# EAGLE design Elect_5pulgadas_v1 (EAGLE 8.7.0)
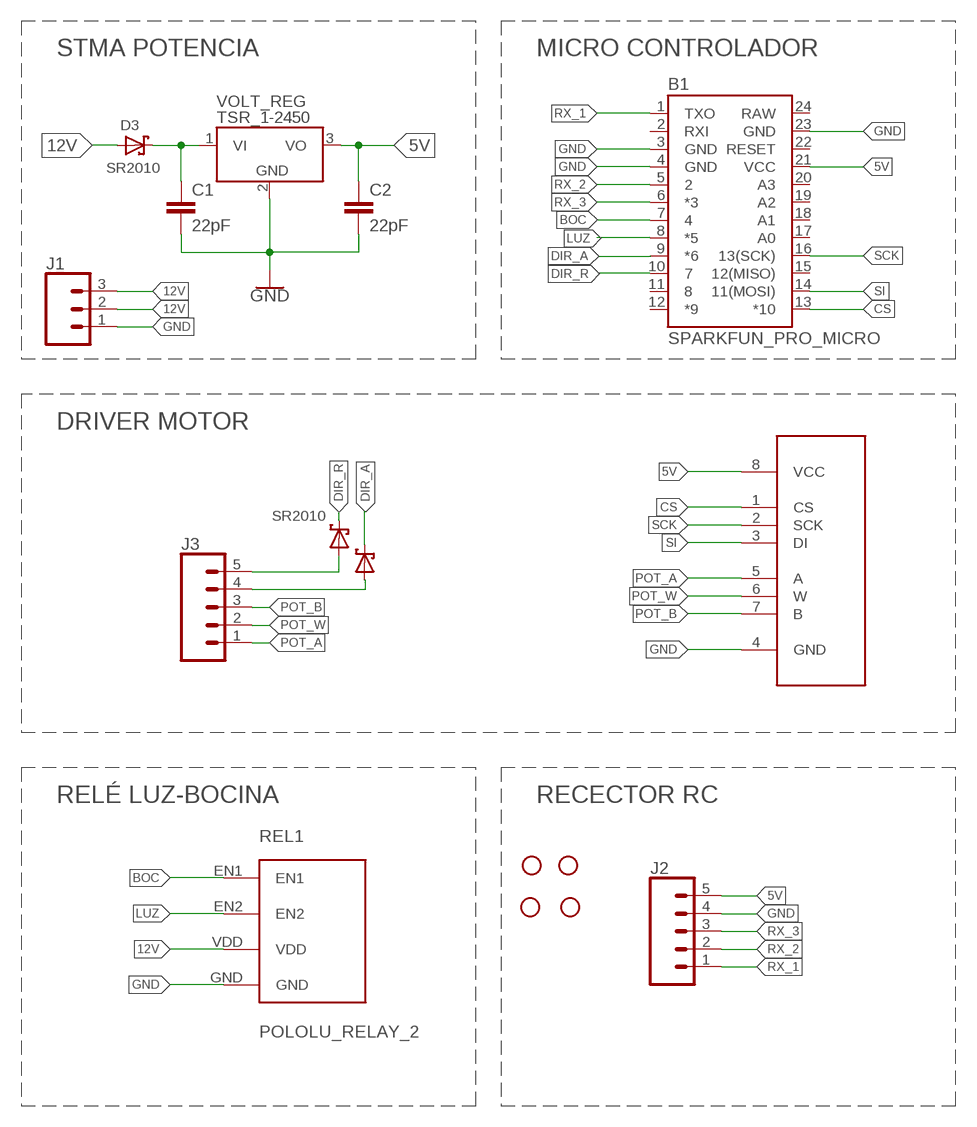
[diagram p0: schematic, sheet 1]

## Parts
B1  SPARKFUN_PRO_MICRO  [SPARKFUN_PRO_MICRO]
C1  22pF  0.1UF-KIT-EZ-50V-20%  [CAP-PTH-SMALL-KIT]
C2  22pF  0.1UF-KIT-EZ-50V-20%  [CAP-PTH-SMALL-KIT]
D1  SR2010  1N5817-B  [DO41-7.6]
D2  SR2010  1N5817-B  [DO41-7.6]
D3  SR2010  1N5817-B  [DO41-7.6]
H1  STAND-OFF  [STAND-OFF]
H2  STAND-OFF  [STAND-OFF]
H3  STAND-OFF  [STAND-OFF]
H4  STAND-OFF  [STAND-OFF]
J1  CONN_03-SCREW-5MM  [SCREWTERMINAL-5MM-3]
J2  CONN_05  [1X05]
J3  CONN_05  [1X05]
REL1  POLOLU_RELAY_2  [POLOLU_RELAY_2]
U1  MCP41XXX  MCP41XXXDIL  [DIP08]
VOLT_REG  TSR_1-2450  [TSR-1]

## Nets
5V: B1.21(VCC) C2.1 J2.5 U1.8(VCC) VOLT_REG.3(VO)
12V: D3.A J1.2 J1.3 REL1.VDD
BOC: B1.7 REL1.EN1
CS: B1.13(*10) U1.1(CS)
DIR_A: B1.9(*6) D1.C
DIR_R: B1.10 D2.C
GND: B1.3(GND) B1.4(GND) B1.23(GND) C1.2 C2.2 J1.1 J2.4 REL1.GND U1.4(GND) VOLT_REG.2(GND)
LUZ: B1.8(*5) REL1.EN2
N$6: D1.A J3.4
N$7: D2.A J3.5
POT_A: J3.1 U1.5(A)
POT_B: J3.3 U1.7(B)
POT_W: J3.2 U1.6(W)
RX_1: B1.1(TXO) J2.1
RX_2: B1.5 J2.2
RX_3: B1.6(*3) J2.3
SCK: B1.16(13(SCK)) U1.2(SCK)
SI: B1.14(11(MOSI)) U1.3(DI)
VI: C1.1 D3.C VOLT_REG.1(VI)
Unconnected: B1.2(RXI) B1.11 B1.12(*9) B1.15(12(MISO)) B1.17(A0) B1.18(A1) B1.19(A2) B1.20(A3) B1.22(RESET)

## Notes on the sheet
- STMA POTENCIA | MICRO CONTROLADOR
- DRIVER MOTOR
- RELÉ LUZ-BOCINA | RECECTOR RC

## Power pins joined to a net without a drawn wire
RAW: B1.24(RAW)

## Library data of the parts
B1 = SparkFun-Boards:SPARKFUN_PRO_MICRO: SparkFun Pro Micro Atmega32U4 compatible footprint. SparkFun Products: 3.3V/8MHz <https://www.sparkfun.com/products/12587> 5V/16MHz <https://www.sparkfun.com/products/12640>
C1 C2 = SparkFun-Capacitors:0.1UF: 0.1µF ceramic capacitors A capacitor is a passive two-terminal electrical component used to store electrical energy temporarily in an electric field.; PROD_ID: CAP-08370; VALUE: 0.1uF
D1-D3 = _mod_diode:1N581*: 1.0A SCHOTTKY BARRIER RECTIFIER Source: http://www.diodes.com/datasheets/ds23001.pdf
H1-H4 = SparkFun-Hardware:STAND-OFF: Stand Off Drill holes for mechanically mounting via screws, standoffs, etc. Note: Use the keepout ring to avoid running the screw head into surrounding components. Variant Overviews STAND-OFF - Mechanical footprint for a #4 phillips button head screw. STAND-OFF-TIGHT - Mechanical footprint for a #4 phillips button head screw, Example SparkFun Products Screw - Phillips Head (1/4", 4-40, 10 pack) <https://www.sparkfun.com/products/10453> (PRT-10453) Screw - Phillips Head (1/2", 4-40, 10 pack) <https://www.sparkfun.com/products/10452> (PRT-10452) Screw - Phillips Head (3/4", 4-40, 10 pack) <https://www.sparkfun.com/products/10451> (PRT-10451) Screw - Phillips Head (1", 4-40, 10 pack) <https://www.sparkfun.com/products/10450> (PRT-10450)
J1 = SparkFun-Connectors:CONN_03: Multi connection point. Often used as Generic Header-pin footprint for 0.1 inch spaced/style header connections On any of the 0.1 inch spaced packages, you can populate with these: Break Away Headers - Straight <https://www.sparkfun.com/products/116> (PRT-00116) Break Away Male Headers - Right Angle <https://www.sparkfun.com/products/553> (PRT-00553) Female Headers <https://www.sparkfun.com/products/115> (PRT-00115) Break Away Headers - Machine Pin <https://www.sparkfun.com/products/117> (PRT-00117) Break Away Female Headers - Swiss Machine Pin <https://www.sparkfun.com/products/743> (PRT-00743) Stackable Header - 3 Pin (Female, 0.1") <https://www.sparkfun.com/products/13875> (PRT-13875) For SCREWTERMINALS and SPRING TERMINALS visit here: Screw Terimnals on SparkFun.com <https://www.sparkfun.com/search/results?term=Screw+Terminals> (5mm/3.5mm/2.54mm spacing) This device is also useful as a general connection point to wire up your design to another part of your project. Our various solder wires solder well into these plated through hole pads. Hook-Up Wire - Assortment (Stranded, 22 AWG) <https://www.sparkfun.com/products/11375> (PRT-11375) Hook-Up Wire - Assortment (Solid Core, 22 AWG) <https://www.sparkfun.com/products/11367> (PRT-11367) View the entire wire category on our website here <https://www.sparkfun.com/categories/141> Special notes: Molex polarized connector foot print use with SKU : PRT-08232 with associated crimp pins and housings.; PROD_ID: CONN-10134; SF_SKU: PRT-08433
J2 J3 = SparkFun-Connectors:CONN_05: Multi connection point. Often used as Generic Header-pin footprint for 0.1 inch spaced/style header connections On any of the 0.1 inch spaced packages, you can populate with these: Break Away Headers - Straight <https://www.sparkfun.com/products/116> (PRT-00116) Break Away Male Headers - Right Angle <https://www.sparkfun.com/products/553> (PRT-00553) Female Headers <https://www.sparkfun.com/products/115> (PRT-00115) Break Away Headers - Machine Pin <https://www.sparkfun.com/products/117> (PRT-00117) Break Away Female Headers - Swiss Machine Pin <https://www.sparkfun.com/products/743> (PRT-00743) For SCREWTERMINALS and SPRING TERMINALS visit here: Screw Terimnals on SparkFun.com <https://www.sparkfun.com/search/results?term=Screw+Terminals> (5mm/3.5mm/2.54mm spacing) This device is also useful as a general connection point to wire up your design to another part of your project. Our various solder wires solder well into these plated through hole pads. Hook-Up Wire - Assortment (Stranded, 22 AWG) <https://www.sparkfun.com/products/11375> (PRT-11375) Hook-Up Wire - Assortment (Solid Core, 22 AWG) <https://www.sparkfun.com/products/11367> (PRT-11367) View the entire wire category on our website here <https://www.sparkfun.com/categories/141> Special notes: Molex polarized connector foot print use with SKU : PRT-08231 with associated crimp pins and housings. 1MM SMD Version SKU: PRT-10208
REL1 = POLOLU_RELAY_2:POLOLU_RELAY_2
U1 = SparkFun-IC-Special-Function:MCP41XXX: Digital Potentiometer - 10K SPI controlled single digital potentiometer by Microchip Datasheet <http://cdn.sparkfun.com/datasheets/Components/General%20IC/22060b.pdf> SparkFun Products Storefront component: Digital Potentiometer - 10K <https://www.sparkfun.com/products/10613> (COM-10613); PROD_ID: RES-13155
VOLT_REG = _traco_tsr-1:TSR_1-*: TRACO TSR-1 Series Point-of-Load DC/DC-Converters Vi max. 36 V; Vo = (1.2 .. 15)V ±2%; Io = 0 .. 1 A SIP-Package (drop-in replacement for 78xx linear voltage regulators in TO220-package, vertically assembled) Source: www.tracopower.com Technologies: TSR 1- Vi (V) Vo (V) ±2% Io = 0 .. 1 A 24_ ( generic ) 2412 4.6 .. 36 1.2 2415 4.6 .. 36 1.5 2418 4.6 .. 36 1.8 2425 4.6 .. 36 2.5 2433 4.75.. 36 3.3 2450 6.5 .. 36 5.0 2465 9.0 .. 36 6.5 2490 12 .. 36 9.0 24120 15 .. 36 12 24150 18 .. 36 15 Author: Dipl.-Ing. FH Rainer Bayer HHN Hochschule Heilbronn, rainer.bayer@hs-heilbronn.de Ingenieurbüro ing-rb, mail@ing-rb.de

## Board
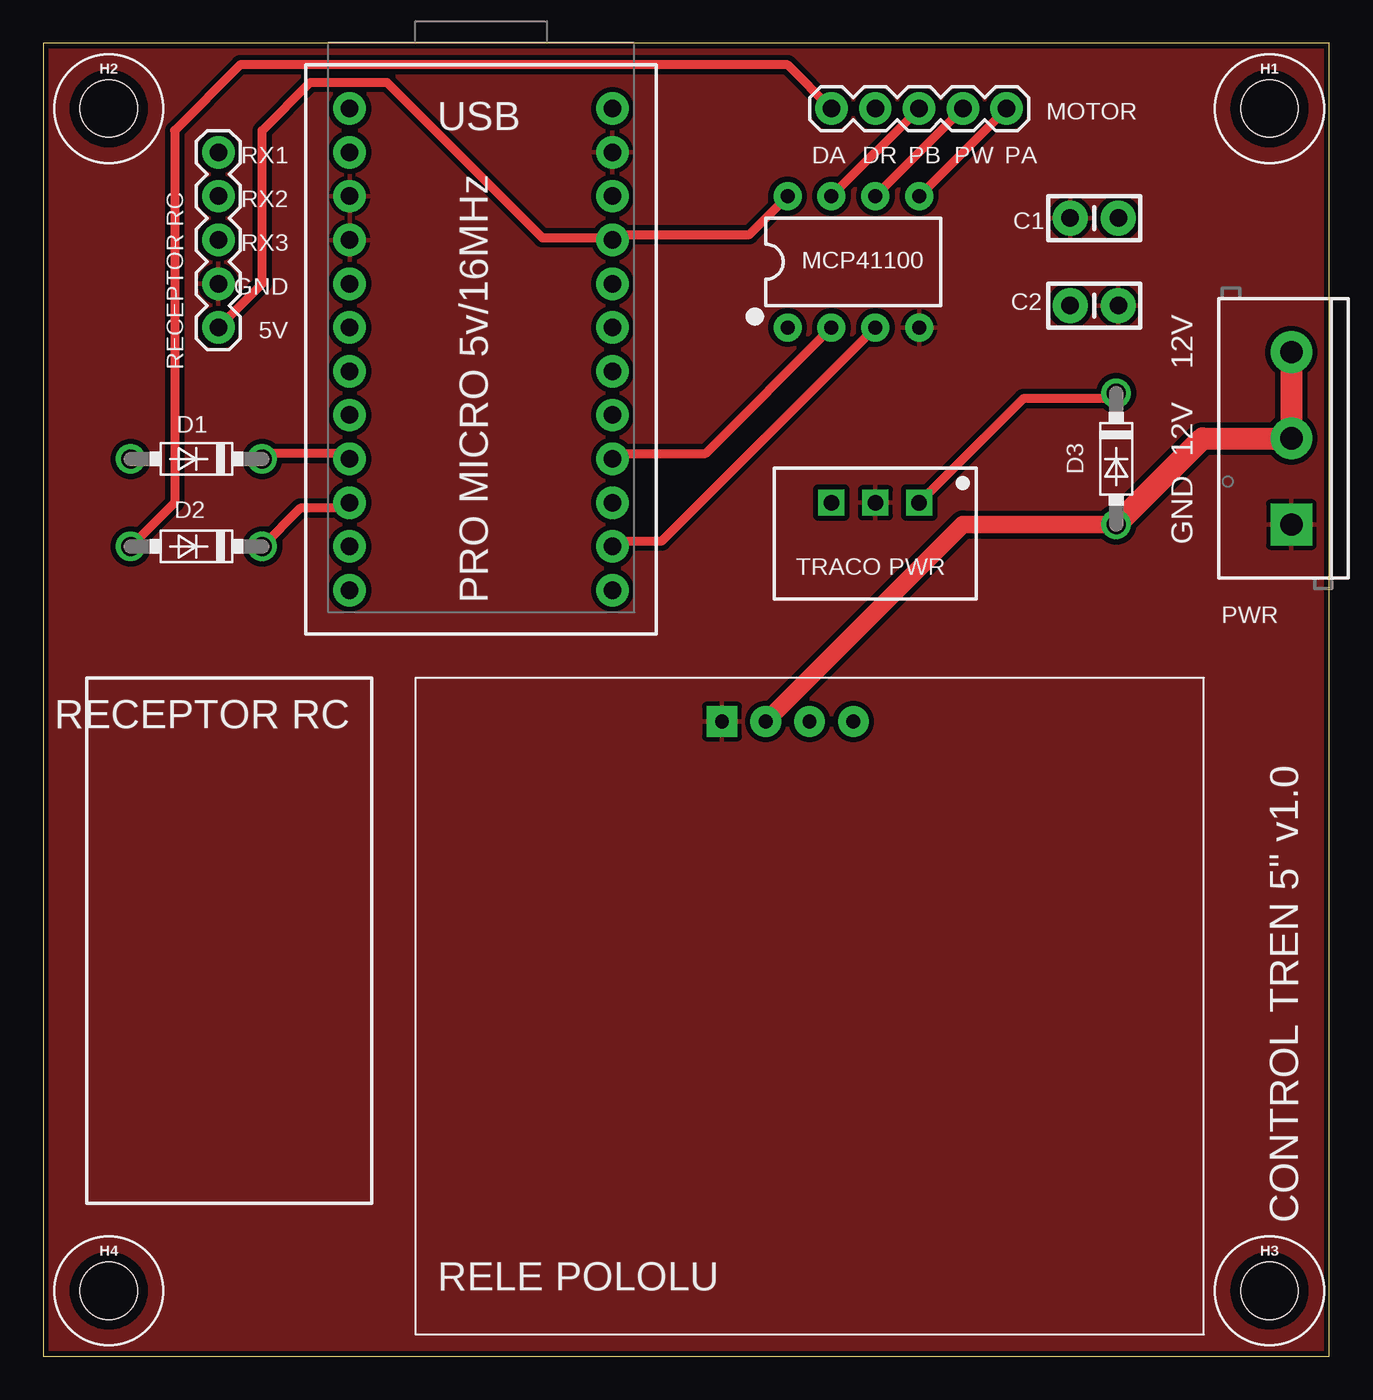
[diagram p1: board, top side]
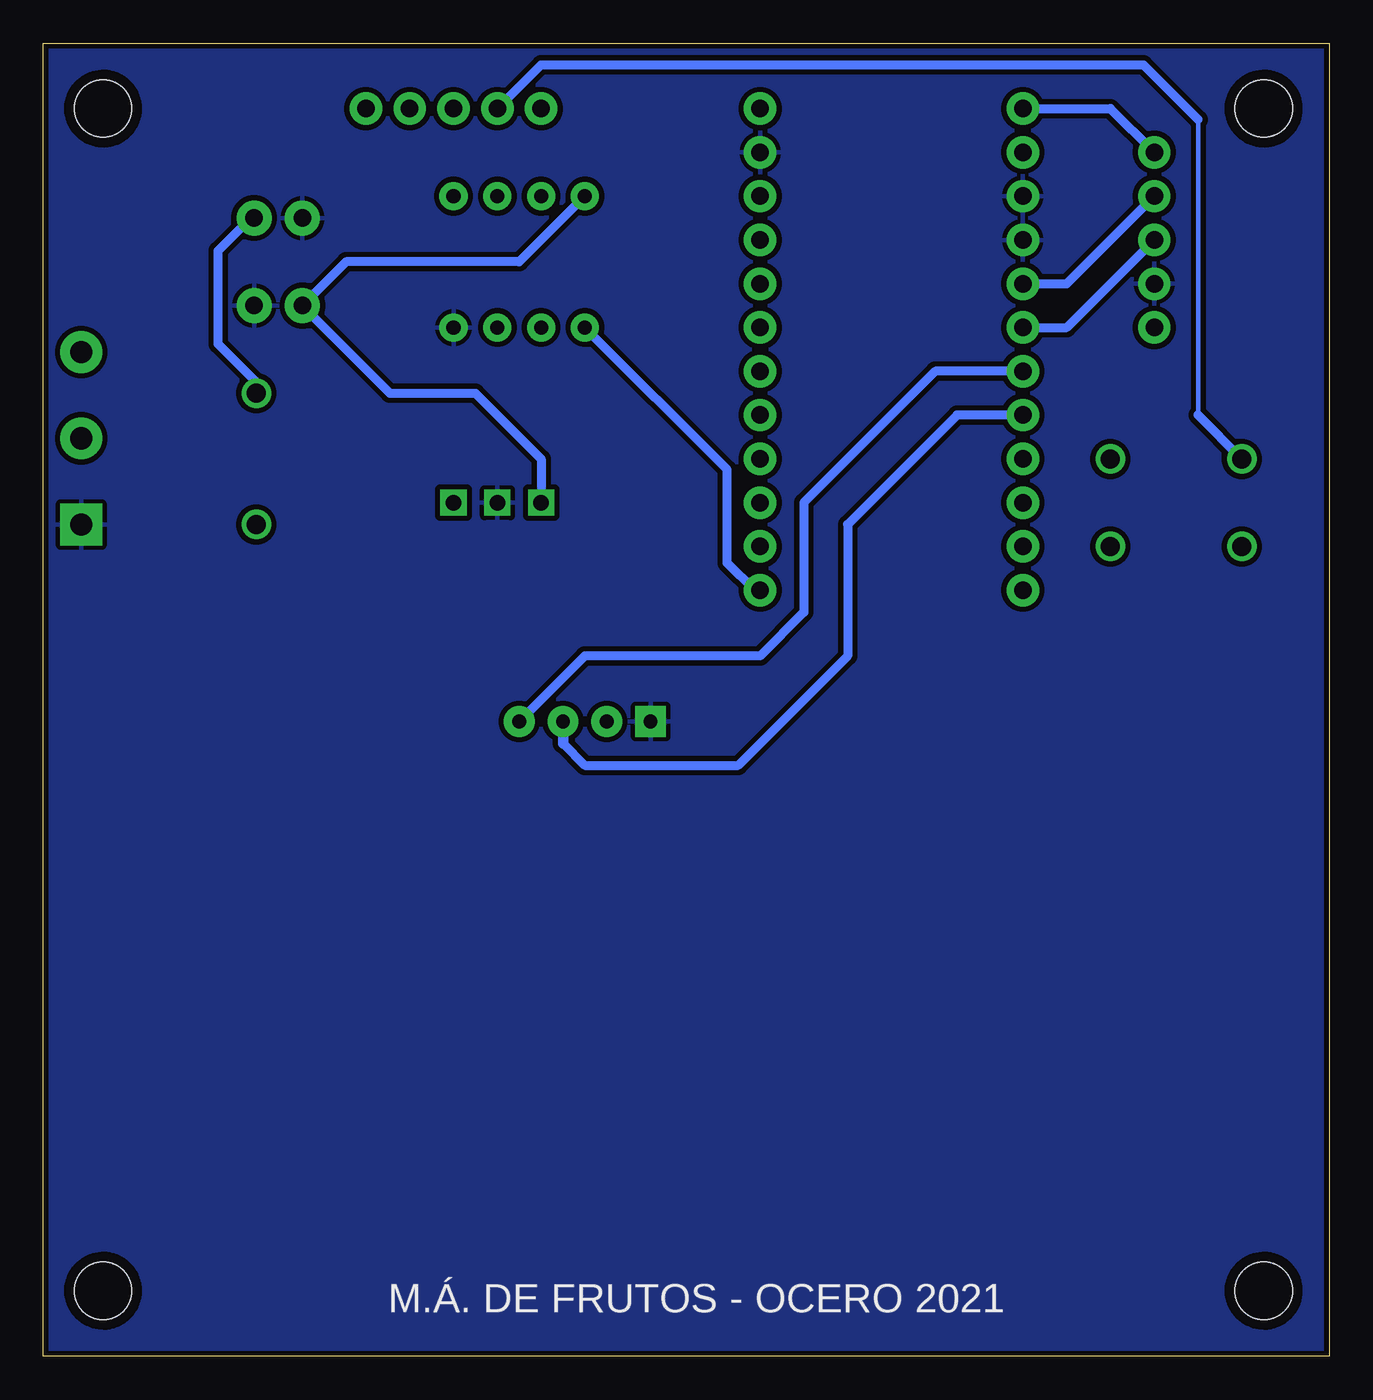
[diagram p2: board, bottom side, seen from below]

Size 74.6 x 76.19 mm. Coordinates in mm from the lower left corner, seen from the top.
Outline: 0,0 74.6,0 74.6,76.19 0,76.19 0,0
Copper layers (1*16): Top 0.035mm / dielectric 1.5mm / Bottom 0.035mm
Design rules "SparkFun": minimum track width 8mil, minimum drill 20mil, track to track 8mil, track to pad 8mil, pad to pad 8mil, via to via 8mil, smd to smd 8mil, copper to edge 8mil, drill to drill 8mil, minimum pad ring 12mil, minimum via ring 10mil, stop-mask expansion 4mil, vias tented up to drill 20mil, thermal gap 10mil

### Footprints (pad centres in the part's own frame; a part is rotated, then mirrored left to right if it is on the bottom)
SPARKFUN_PRO_MICRO = drill 1.016 pad 1.88: 1 -7.62,12.7; 2 -7.62,10.16; 3 -7.62,7.62; 4 -7.62,5.08; 5 -7.62,2.54; 6 -7.62,0; 7 -7.62,-2.54; 8 -7.62,-5.08; 9 -7.62,-7.62; 10 -7.62,-10.16; 11 -7.62,-12.7; 12 -7.62,-15.24; 13 7.62,-15.24; 14 7.62,-12.7; 15 7.62,-10.16; 16 7.62,-7.62; 17 7.62,-5.08; 18 7.62,-2.54; 19 7.62,0; 20 7.62,2.54; 21 7.62,5.08; 22 7.62,7.62; 23 7.62,10.16; 24 7.62,12.7
CAP-PTH-SMALL-KIT = drill 1.016 pad 2.032: 1 -1.397,0; 2 1.397,0
DO41-7.6 = drill 1.1 pad 1.7: A 3.81,0; C -3.81,0
STAND-OFF = hole 3.302: 0,0
SCREWTERMINAL-5MM-3 = drill 1.3 pad 2.413 square: 1 0,0 | drill 1.3 pad 2.413: 2 5,0; 3 10,0
1X05 = drill 1.016 pad 1.88: 1 0,0; 2 2.54,0; 3 5.08,0; 4 7.62,0; 5 10.16,0
POLOLU_RELAY_2 = drill 0.8 pad 1.778: EN1 2.54,-20.32; EN2 2.54,-22.86; VDD 2.54,-25.4 | drill 0.8 pad 1.778 square: GND 2.54,-27.94
DIP08 = drill 0.813 pad 1.626: 1 -3.81,-3.81; 2 -1.27,-3.81; 3 1.27,-3.81; 4 3.81,-3.81; 5 3.81,3.81; 6 1.27,3.81; 7 -1.27,3.81; 8 -3.81,3.81
TSR-1 = drill 0.9 square: 1 -2.54,0; 2 0,0; 3 2.54,0

### Placement (x,y rotation side)
B1  25.4,59.69 0 top
C1  60.96,66.04 180 top
C2  60.96,60.96 0 top
D1  8.89,52.07 180 top
D2  8.89,46.99 180 top
D3  62.23,52.07 270 top
H1  71.12,72.39 0 top
H2  3.81,72.39 0 top
H3  71.12,3.81 0 top
H4  3.81,3.81 0 top
J1  72.39,48.26 90 top
J2  10.16,69.85 270 top
J3  55.88,72.39 180 top
REL1  67.31,39.37 270 top
U1  46.99,63.5 0 top
VOLT_REG  48.26,49.53 180 top

### Tracks (layer width: path | path; a pad name or v marks a point on that pad's centre or on a via)
5V
  Top 0.203: B1.21 33.15,64.9 33.34,65.09
  Top 0.508: U1.8 40.96,65.09 33.34,65.09 | J2.5 12.7,62.23 12.7,71.12 15.49,73.91 19.94,73.91 28.96,64.9 33.15,64.9
  Bottom 0.508: U1.8 46.99,63.5 57.02,63.5 C2.1 54.48,55.88 49.53,55.88 45.72,52.07 VOLT_REG.3
12V
  Top 1.016: REL1.VDD 53.34,48.26 D3.A
  Top 1.27: D3.A 67.23,53.26 J1.2 J1.3
BOC
  Bottom 0.508: B1.7 22.86,57.15 30.48,49.53 30.48,43.18 33.02,40.64 43.18,40.64 REL1.EN1
CS
  Bottom 0.203: B1.13 33.34,44.45
  Bottom 0.508: U1.1 34.92,51.43 34.92,46.04 33.34,44.45
DIR_A
  Top 0.508: D1.C 13.02,52.39 17.46,52.39 B1.9
DIR_R
  Top 0.254: B1.10 17.46,49.21
  Top 0.508: D2.C 14.92,49.21 17.46,49.21
GND
  pour Top (isolate 0.305): 0,76.2 74.93,76.2 74.93,0 0,0
  pour Bottom (isolate 0.305): 0,76.2 74.93,76.2 74.93,0 0,0
LUZ
  Bottom 0.508: B1.8 21.59,54.61 27.94,48.26 27.94,40.64 34.29,34.29 43.18,34.29 44.45,35.56
  Bottom 0.61: REL1.EN2 44.45,35.56
N$6
  Bottom 0.254: 7.62,71.75 7.62,54.61
  Bottom 0.508: J3.4 45.72,74.93 10.79,74.93 7.62,71.75 | 7.62,54.61 D1.A
N$7
  Top 0.508: J3.5 43.18,74.93 11.43,74.93 7.62,71.12 7.62,49.53 D2.A
POT_A
  Top 0.508: J3.1 U1.5
POT_B
  Top 0.508: J3.3 U1.7
POT_W
  Top 0.508: J3.2 U1.6
RX_1
  Bottom 0.508: B1.1 12.7,72.39 J2.1
RX_2
  Bottom 0.508: B1.5 15.24,62.23 J2.2
RX_3
  Bottom 0.508: B1.6 15.24,59.69 J2.3
SCK
  Top 0.203: B1.16 33.34,52.39
  Top 0.508: U1.2 38.42,52.39 33.34,52.39
SI
  Top 0.203: B1.14 33.34,47.31
  Top 0.508: U1.3 35.88,47.31 33.34,47.31
VI
  Top 0.203: D3.C 61.91,55.56
  Top 0.508: VOLT_REG.1 56.83,55.56 61.91,55.56
  Bottom 0.203: D3.C 62.23,56.52 | 62.55,66.04 C1.1
  Bottom 0.508: 62.55,66.04 64.45,64.13 64.45,58.74 62.23,56.52

### Text on the board
tNames: MOTOR | USB | RX1 | DA | DR | PB | PW | PA | RX2 | PRO MICRO 5v/16MHz | RECEPTOR RC | RX3 | C1 | MCP41100 | GND | C2 | 5V | 12V | D1 | 12V | D3 | D2 | GND | TRACO PWR | PWR | RECEPTOR RC | CONTROL TREN 5" v1.0 | RELE POLOLU
bNames: M.Á. DE FRUTOS - OCERO 2021